# Altium schematic sheet INTERFACE.SchDoc
size A3
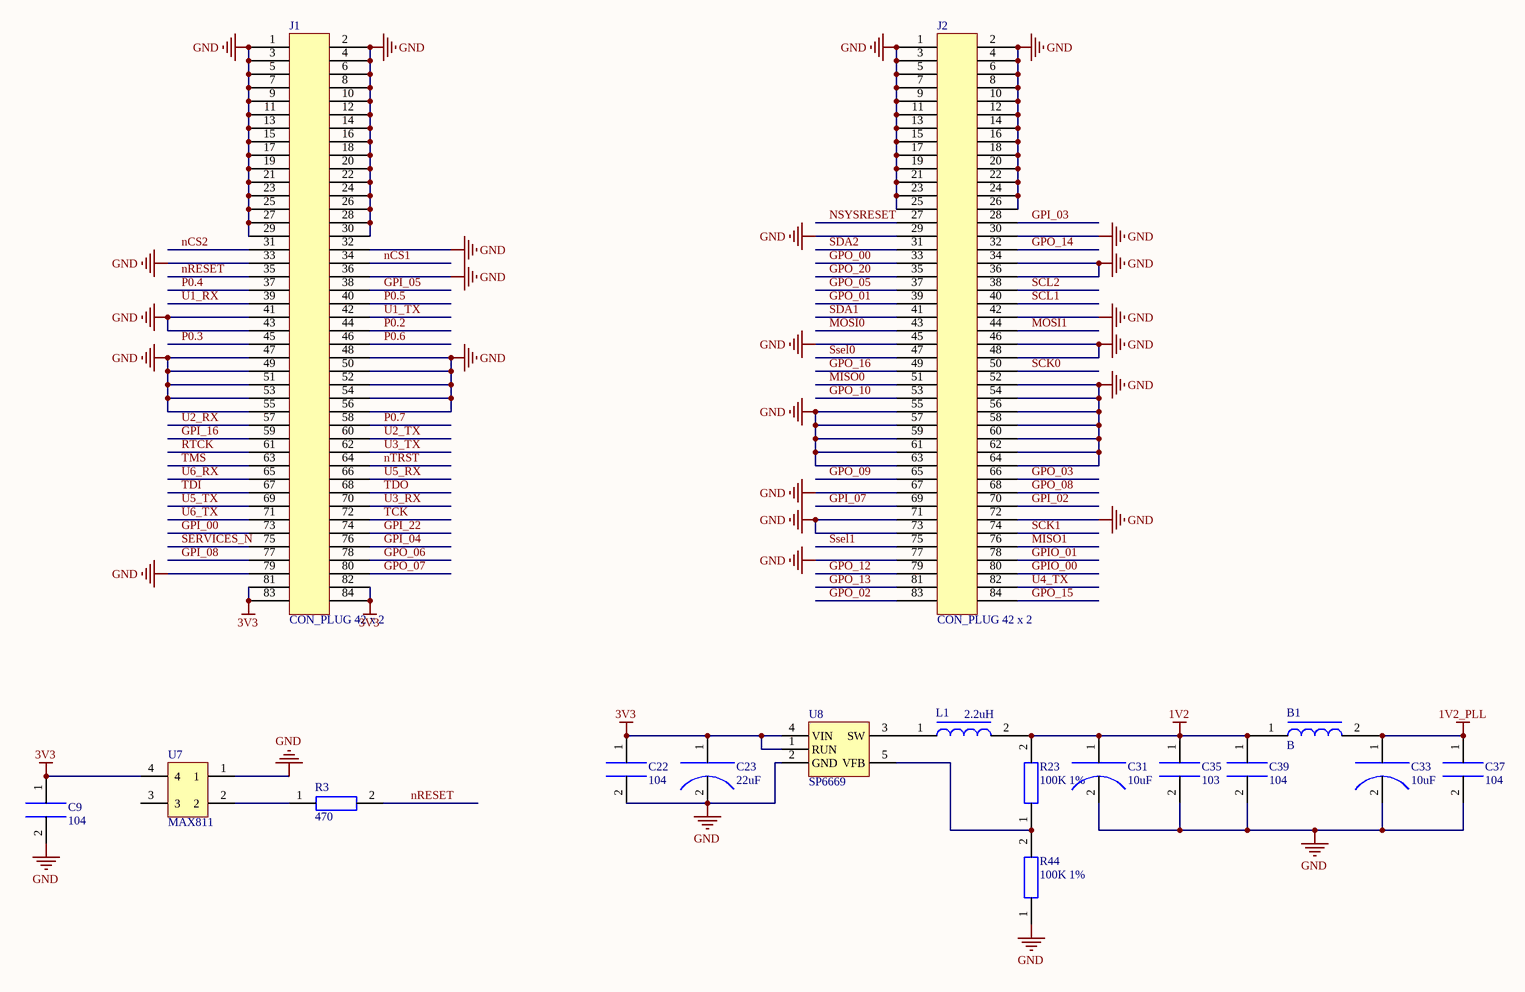
[diagram p0: INTERFACE.SchDoc]

## Parts
B1  B  [0603]
C9  104  [0603C]
C22  104  [0603C]
C23  22uF  [TC-3528]
C31  10uF  [TC-3528]
C33  10uF  [TC-3528]
C35  103  [0603C]
C37  104  [0603C]
C39  104  [0603C]
J1  CON_PLUG 42 x 2  [DIP84]
J2  CON_PLUG 42 x 2  [DIP84]
L1  2.2uH  [0805]
R3  470  [0603R]
R23  100K 1%  [0603R]
R44  100K 1%  [0603R]
U7  MAX811  [MAX811]
U8  SP6669  [SOT-23-5]

## Nets
1V2: B1.1 C31.1 C35.1 C39.1 L1.2 R23.2
1V2_PLL: B1.2 C33.1 C37.1
3V3: C9.1 C22.1 C23.1 J1.81 J1.82 J1.83 J1.84 U7.4 U8.1(RUN) U8.4(VIN)
GND: C9.2 C22.2 C23.2 C31.2 C33.2 C35.2 C37.2 C39.2 J1.1 J1.2 J1.3 J1.4 J1.5 J1.6 J1.7 J1.8 J1.9 J1.10 J1.11 J1.12 J1.13 J1.14 J1.15 J1.16 J1.17 J1.18 J1.19 J1.20 J1.21 J1.22 J1.23 J1.24 J1.25 J1.26 J1.27 J1.28 J1.29 J1.30 J1.32 J1.33 J1.36 J1.41 J1.43 J1.47 J1.48 J1.49 J1.50 J1.51 J1.52 J1.53 J1.54 J1.55 J1.56 J1.79 J2.1 J2.2 J2.3 J2.4 J2.5 J2.6 J2.7 J2.8 J2.9 J2.10 J2.11 J2.12 J2.13 J2.14 J2.15 J2.16 J2.17 J2.18 J2.19 J2.20 J2.21 J2.22 J2.23 J2.24 J2.25 J2.26 J2.29 J2.30 J2.34 J2.36 J2.42 J2.45 J2.46 J2.48 J2.52 J2.54 J2.55 J2.56 J2.57 J2.58 J2.59 J2.60 J2.61 J2.62 J2.63 J2.64 J2.67 J2.71 J2.72 J2.73 J2.77 R44.1 U7.1 U8.2(GND)
GPI_00: J1.73
GPI_02: J2.70
GPI_03: J2.28
GPI_04: J1.76
GPI_05: J1.38
GPI_07: J2.69
GPI_08: J1.77
GPI_16: J1.59
GPI_22: J1.74
GPIO_00: J2.80
GPIO_01: J2.78
GPO_00: J2.33
GPO_01: J2.39
GPO_02: J2.83
GPO_03: J2.66
GPO_05: J2.37
GPO_06: J1.78
GPO_07: J1.80
GPO_08: J2.68
GPO_09: J2.65
GPO_10: J2.53
GPO_12: J2.79
GPO_13: J2.81
GPO_14: J2.32
GPO_15: J2.84
GPO_16: J2.49
GPO_20: J2.35
MISO0: J2.51
MISO1: J2.76
MOSI0: J2.43
MOSI1: J2.44
nCS1: J1.34
nCS2: J1.31
nRESET: J1.35 R3.2
NSYSRESET: J2.27
nTRST: J1.64
P0.2: J1.44
P0.3: J1.45
P0.4: J1.37
P0.5: J1.40
P0.6: J1.46
P0.7: J1.58
RTCK: J1.61
SCK0: J2.50
SCK1: J2.74
SCL1: J2.40
SCL2: J2.38
SDA1: J2.41
SDA2: J2.31
SERVICES_N: J1.75
Ssel0: J2.47
Ssel1: J2.75
TCK: J1.72
TDI: J1.67
TDO: J1.68
TMS: J1.63
U1_RX: J1.39
U1_TX: J1.42
U2_RX: J1.57
U2_TX: J1.60
U3_RX: J1.70
U3_TX: J1.62
U4_TX: J2.82
U5_RX: J1.66
U5_TX: J1.69
U6_RX: J1.65
U6_TX: J1.71
NetL1_1: L1.1 U8.3(SW)
NetR3_1: R3.1 U7.2
NetR23_1: R23.1 R44.2 U8.5(VFB)

Not connected (* = marked no-connect by the designer): U7 3

## Library data of the parts
C9 C22 C35 C37 C39 = CAP
C23 C31 C33 = CAP_1
L1 = INDUCTOR
R3 R23 R44 = RES